# EAGLE schematic 555_Timer (EAGLE 9.3.2)
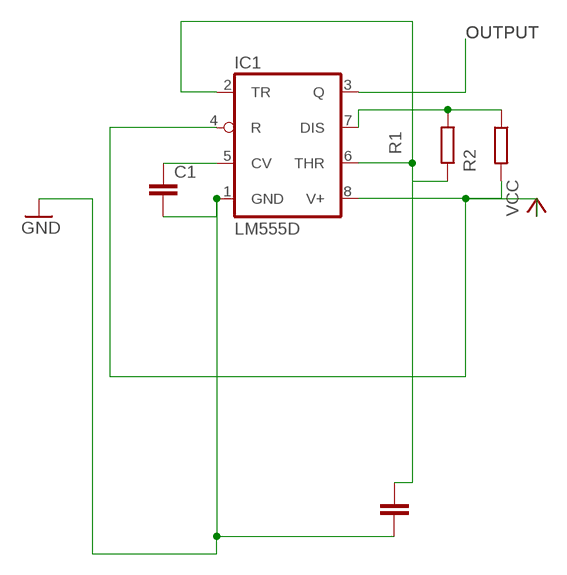
[diagram p0: schematic, sheet 1]

## Parts
C1  C-EU025-024X044  [C025-024X044]
C3  C-EU025-024X044  [C025-024X044]
IC1  LM555D  [SO08]
R1  R-EU_0204/5  [0204/5]
R2  R-EU_0204/5  [0204/5]

## Nets
GND: C1.2 C3.2 IC1.1(GND)
N$1: IC1.7(DIS) R1.2 R2.1
N$2: C3.1 IC1.2(TR) IC1.6(THR) R1.1
N$6: C1.1 IC1.5(CV)
OUTPUT: IC1.3(Q)
VCC: IC1.4(R) IC1.8(V+) R2.2

## Library data of the parts
C1 C3 = rcl:C-EU: CAPACITOR, European symbol; SPICEPREFIX: C
IC1 = linear:*555: TIMER
R1 R2 = rcl:R-EU_: RESISTOR, European symbol; SPICEPREFIX: R